# EAGLE design ArduRT-v4 (EAGLE 5.07)
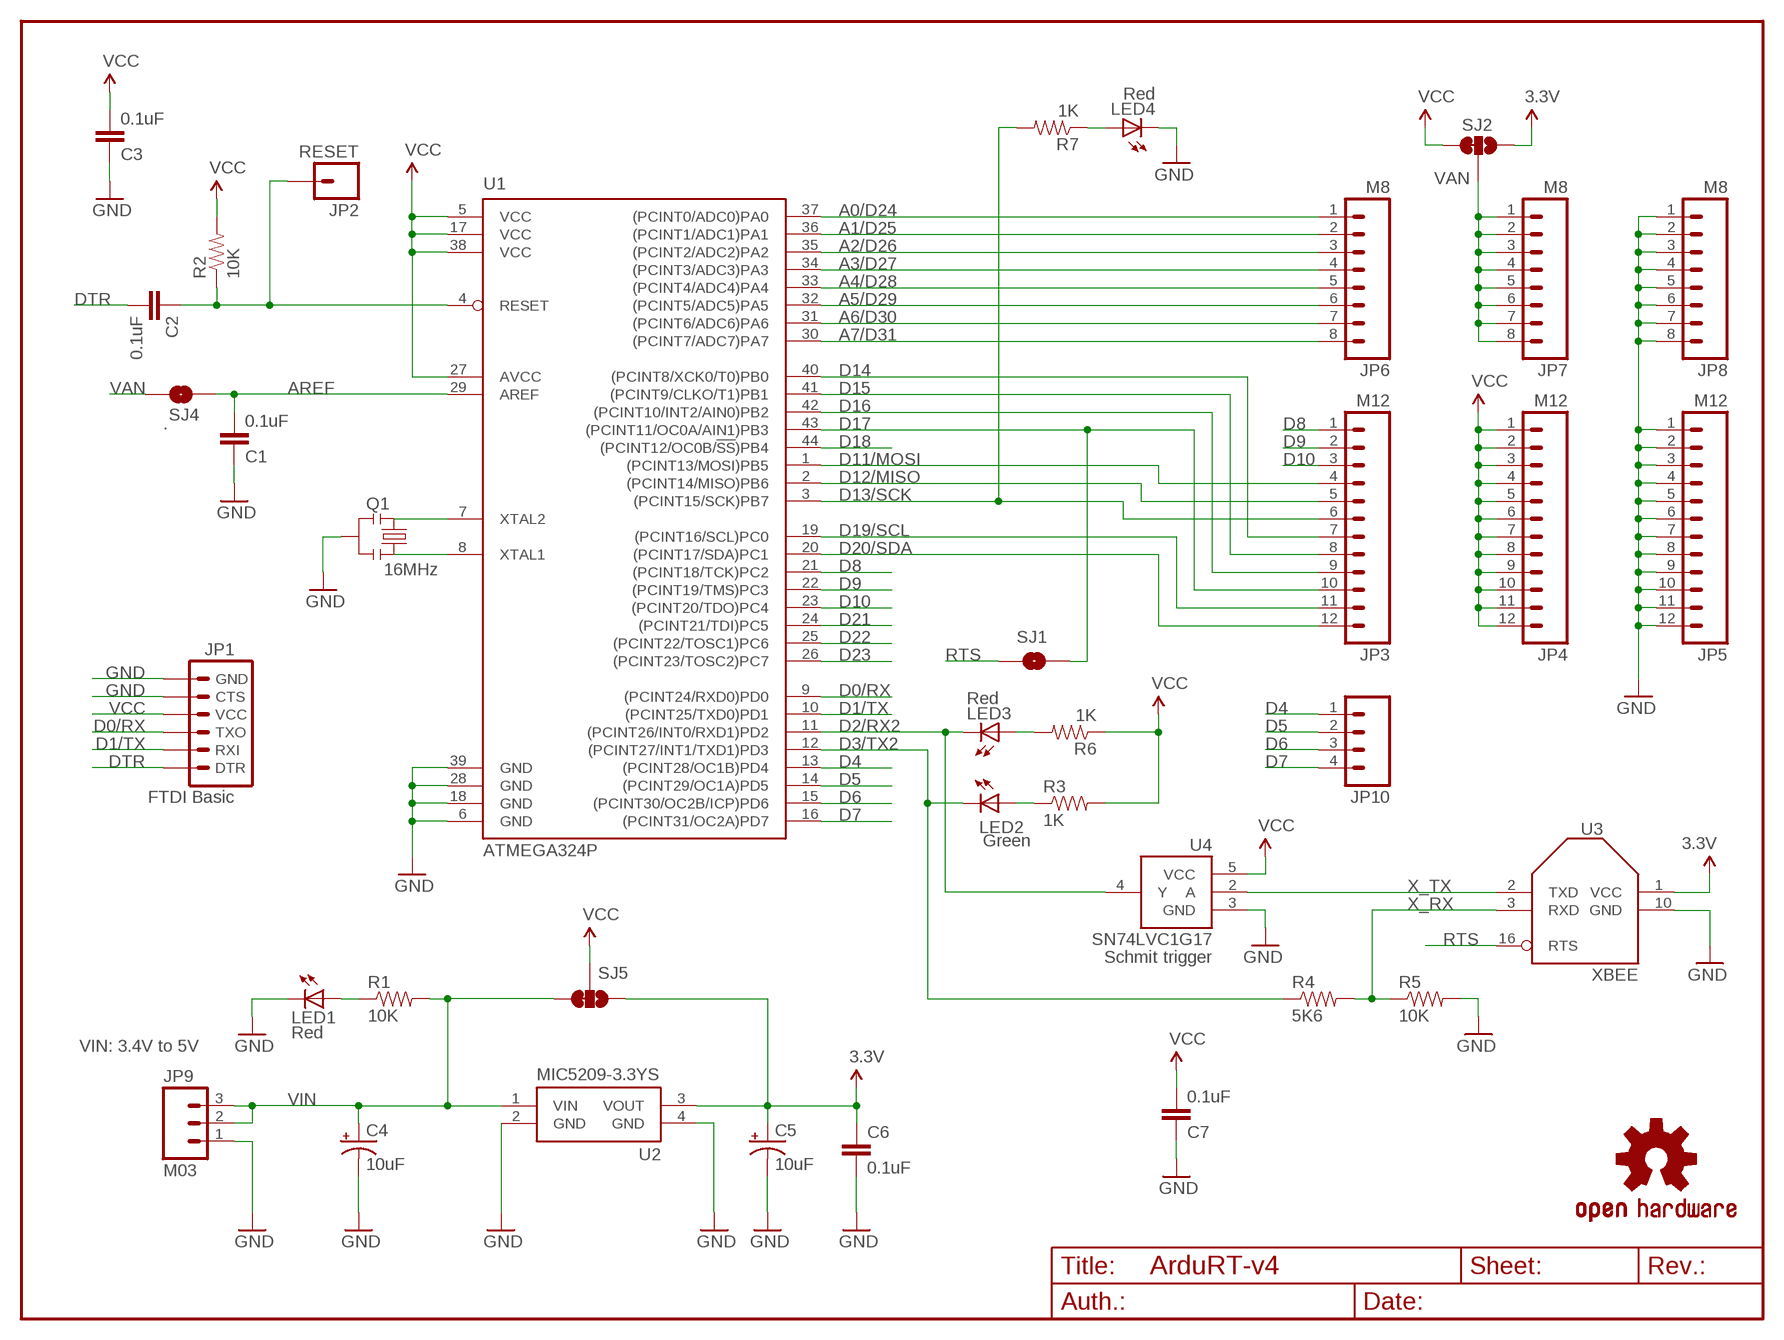
[diagram p0: schematic, sheet 1]

## Parts
C1  0.1uF  CAP0805  [0805]
C2  0.1uF  CAP0805  [0805]
C3  0.1uF  CAP0805  [0805]
C4  10uF  CAP_POL1206  [EIA3216]
C5  10uF  CAP_POL1206  [EIA3216]
C6  0.1uF  CAP0805  [0805]
C7  0.1uF  CAP0805  [0805]
JP1  FTDI Basic  ARDUINO_SERIAL_PROGRAMPTH  [1X06]
JP2  RESET  M01PTH  [1X01]
JP3  M12  M12PTH  [1X12]
JP4  M12  M12PTH  [1X12]
JP5  M12  M12PTH  [1X12]
JP6  M8  M08  [1X08]
JP7  M8  M08  [1X08]
JP8  M8  M08  [1X08]
JP9  M03  [1X3_LONGPAD]
JP10  M04  [1X04]
LED1  Red  LED805  [LED-0805]
LED2  Green  LED805  [LED-0805]
LED3  Red  LED805  [LED-0805]
LED4  Red  LED805  [LED-0805]
Q1  16MHz  RESONATORSMD  [RESONATOR-SMD]
R1  10K  RESISTOR0805-RES  [0805]
R2  10K  RESISTOR0805-RES  [0805]
R3  1K  RESISTOR0805-RES  [0805]
R4  5K6  RESISTOR0805-RES  [0805]
R5  10K  RESISTOR0805-RES  [0805]
R6  1K  RESISTOR0805-RES  [0805]
R7  1K  RESISTOR0805-RES  [0805]
SJ1  SOLDERJUMPERNO  [SJ_2S-NO]
SJ2  SJ_2WAYS_1-2W  [SJ_2WAYS_1-2]
SJ4  .  SOLDERJUMPERTRACE  [SJ_2S-TRACE]
SJ5  SJ_2WAYS_1-2W  [SJ_2WAYS_1-2]
U1  ATMEGA324P  ATMEGA324A  [TQFP44]
U2  MIC5209-3.3YS  MIC5209  [SOT223]
U3  XBEE  XBEE-SIMPLE  [XBEE-MIN]
U4  SN74LVC1G17  [SOT23-5]
U$2  OSHW-LOGOS  [OSHW-LOGO-S]

## Nets
3.3V: C5.A(+) C6.1 SJ2.3 SJ5.3 U2.3(VOUT) U3.1(VCC)
A0/D24: JP6.1 U1.37((PCINT0/ADC0)PA0)
A1/D25: JP6.2 U1.36((PCINT1/ADC1)PA1)
A2/D26: JP6.3 U1.35((PCINT2/ADC2)PA2)
A3/D27: JP6.4 U1.34((PCINT3/ADC3)PA3)
A4/D28: JP6.5 U1.33((PCINT4/ADC4)PA4)
A5/D29: JP6.6 U1.32((PCINT5/ADC5)PA5)
A6/D30: JP6.7 U1.31((PCINT6/ADC6)PA6)
A7/D31: JP6.8 U1.30((PCINT7/ADC7)PA7)
AREF: C1.2 SJ4.2 U1.29(AREF)
D0/RX: JP1.3(TXO) U1.9((PCINT24/RXD0)PD0)
D1/TX: JP1.2(RXI) U1.10((PCINT25/TXD0)PD1)
D2/RX2: LED3.2(C) U1.11((PCINT26/INT0/RXD1)PD2) U4.4(Y)
D3/TX2: LED2.2(C) R4.1 U1.12((PCINT27/INT1/TXD1)PD3)
D4: JP10.1 U1.13((PCINT28/OC1B)PD4)
D5: JP10.2 U1.14((PCINT29/OC1A)PD5)
D6: JP10.3 U1.15((PCINT30/OC2B/ICP)PD6)
D7: JP10.4 U1.16((PCINT31/OC2A)PD7)
D8: JP3.1 U1.21((PCINT18/TCK)PC2)
D9: JP3.2 U1.22((PCINT19/TMS)PC3)
D10: JP3.3 U1.23((PCINT20/TDO)PC4)
D11/MOSI: JP3.4 U1.1((PCINT13/MOSI)PB5)
D12/MISO: JP3.5 U1.2((PCINT14/MISO)PB6)
D13/SCK: JP3.6 R7.2 U1.3((PCINT15/SCK)PB7)
D14: JP3.7 U1.40((PCINT8/XCK0/T0)PB0)
D15: JP3.8 U1.41((PCINT9/CLKO/T1)PB1)
D16: JP3.9 U1.42((PCINT10/INT2/AIN0)PB2)
D17: JP3.10 SJ1.2 U1.43((PCINT11/OC0A/AIN1)PB3)
D18: U1.44((PCINT12/OC0B/!SS!)PB4)
D19/SCL: JP3.11 U1.19((PCINT16/SCL)PC0)
D20/SDA: JP3.12 U1.20((PCINT17/SDA)PC1)
D21: U1.24((PCINT21/TDI)PC5)
D22: U1.25((PCINT22/TOSC1)PC6)
D23: U1.26((PCINT23/TOSC2)PC7)
DTR: C2.2 JP1.1(DTR)
GND [vcc]: C1.1 C3.1 C4.C(-) C5.C(-) C6.2 C7.1 JP1.5(CTS) JP1.6(GND) JP5.1 JP5.2 JP5.3 JP5.4 JP5.5 JP5.6 JP5.7 JP5.8 JP5.9 JP5.10 JP5.11 JP5.12 JP8.1 JP8.2 JP8.3 JP8.4 JP8.5 JP8.6 JP8.7 JP8.8 JP9.1 LED1.2(C) LED4.2(C) Q1.2 R5.2 U1.6(GND) U1.18(GND) U1.28(GND) U1.39(GND) U2.2(GND) U2.4(GND) U3.10(GND) U4.3(GND)
N$1: Q1.1 U1.8(XTAL1)
N$2: Q1.3 U1.7(XTAL2)
N$3: LED2.1(A) R3.1
N$4: LED3.1(A) R6.2
N$5: LED4.1(A) R7.1
N$38: LED1.1(A) R1.1
RESET: C2.1 JP2.1 R2.1 U1.4(RESET)
RTS: SJ1.1 U3.16(RTS)
VAN: JP7.1 JP7.2 JP7.3 JP7.4 JP7.5 JP7.6 JP7.7 JP7.8 SJ2.2 SJ4.1
VCC [vcc]: C3.2 C7.2 JP1.4(VCC) JP4.1 JP4.2 JP4.3 JP4.4 JP4.5 JP4.6 JP4.7 JP4.8 JP4.9 JP4.10 JP4.11 JP4.12 R2.2 R3.2 R6.1 SJ2.1 SJ5.2 U1.5(VCC) U1.17(VCC) U1.27(AVCC) U1.38(VCC) U4.5(VCC)
VIN: C4.A(+) JP9.2 JP9.3 R1.2 SJ5.1 U2.1(VIN)
X_RX: R4.2 R5.1 U3.3(RXD)
X_TX: U3.2(TXD) U4.2(A)

## Notes on the sheet
- Schmit trigger
- VIN: 3.4V to 5V

## Library data of the parts
C1-C3 C6 C7 = SparkFun:CAP: Capacitor Standard 0603 ceramic capacitor, and 0.1" leaded capacitor.
C4 C5 = SparkFun:CAP_POL: Capacitor Polarized These are standard SMD and PTH capacitors. Normally 10uF, 47uF, and 100uF in electrolytic and tantalum varieties. Always verify the external diameter of the through hole cap, it varies with capacity, voltage, and manufacturer. The EIA devices should be standard.
JP1 = SparkFun:ARDUINO_SERIAL_PROGRAM
JP2 = SparkFun:M01: Header 1 Standard 1-pin 0.1" header. Use with straight break away headers (SKU : PRT-00116), right angle break away headers (PRT-00553), swiss pins (PRT-00743), machine pins (PRT-00117), and female headers (PRT-00115).
JP3-JP5 = SparkFun:M12: Header 12 Standard 12-pin 0.1" header. Use with straight break away headers (SKU : PRT-00116), right angle break away headers (PRT-00553), swiss pins (PRT-00743), machine pins (PRT-00117), and female headers (PRT-00115).
JP6-JP8 = wibauxl:M08
JP9 = wibauxl:M03
JP10 = wibauxl:M04
LED1-LED4 = wibauxl:LED
Q1 = SparkFun:RESONATOR: Resonator Small SMD resonator. This is the itty bitty 10/20MHz resonators with built in caps. CSTCE10M0G55 and CSTCE20M0V53. Footprint has been reviewed closely but hasn't been tested yet.
R1-R7 = SparkFun:RESISTOR: Resistor Basic schematic elements and footprints for 0603, 1206, and PTH resistors.
SJ1 SJ4 = SparkFun:SOLDERJUMPER: Solder Jumper Standard SMD solder jumper. Used to automate production. Two varients : Normally Open and Normally Closed are the same, but have different paste layers. NC will have a large amount of paste and should jumper during reflow.
SJ2 SJ5 = wibauxl:SJ_2WAYS_1-2
U1 = wibauxl:ATMEGA324: 8-bit Microcontroller with 64K Bytes In-System Programmable Flash Source: http://www.atmel.com/dyn/resources/prod_documents/doc2593.pdf
U2 = wibauxl:MIC5209
U3 = wibauxl:XBEE-SIMPLE
U4 = wibauxl:SN74LVC1G17
U$2 = SparkFun:OSHW-LOGO: Open Source Hardware Logo This logo indicates the piece of hardware it is found on incorporates a OSHW license and/or adheres to the definition of open source hardware found here: http://freedomdefined.org/OSHW

## Net classes
0 default: width 0.203 mm
1 vcc: width 0.254 mm

## Board
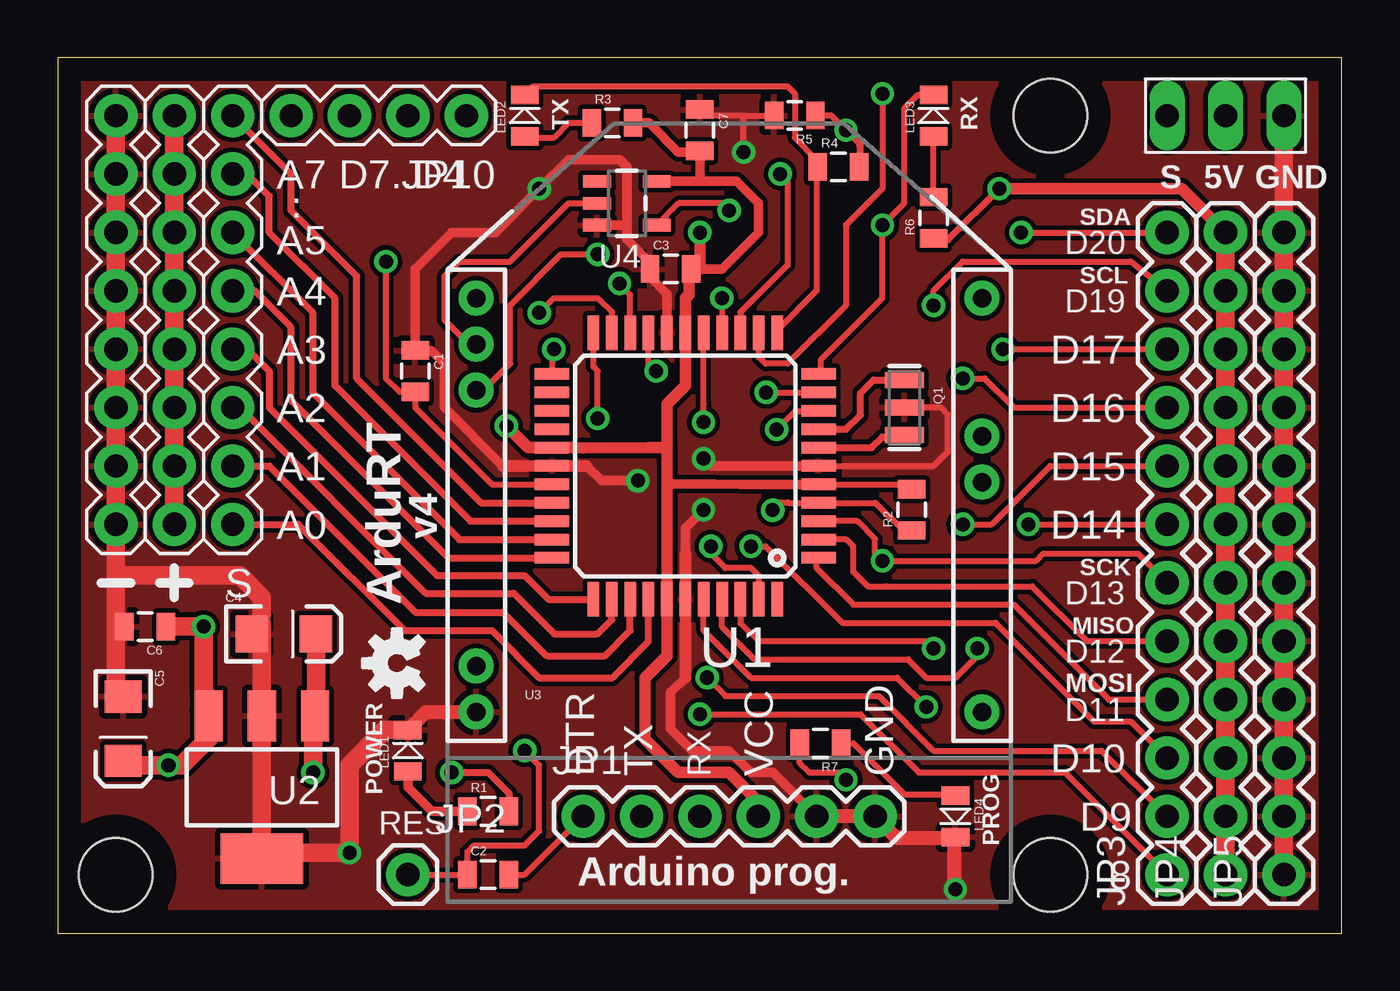
[diagram p1: board, top side]
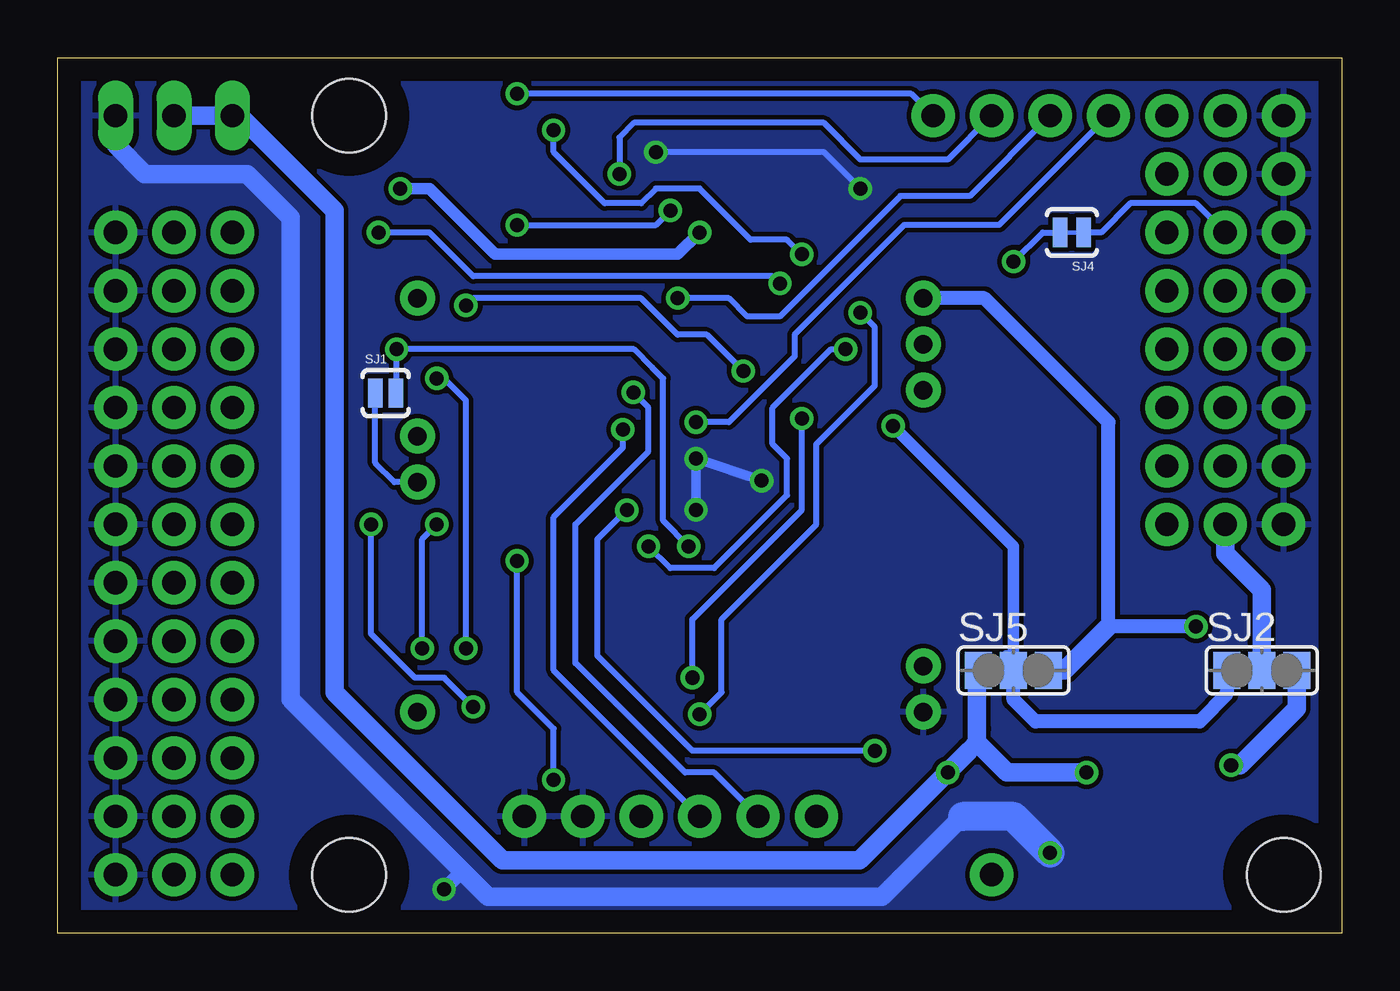
[diagram p2: board, bottom side, seen from below]

Size 55.87 x 38.09 mm. Coordinates in mm from the lower left corner, seen from the top.
Outline: 0,0 55.87,0 55.87,38.09 0,38.09 0,0
Copper layers (1*16): Top 0.035mm / dielectric 1.5mm / Bottom 0.035mm
Design rules "default *": minimum track width 10mil, minimum drill 24mil, track to track 8mil, track to pad 8mil, pad to pad 8mil, via to via 8mil, smd to smd 8mil, copper to edge 40mil, drill to drill 8mil, minimum pad ring 10mil, minimum via ring 8mil, stop-mask expansion 4mil, vias tented up to drill 0mil, thermal gap 10mil
Holes 3.2 mm at 43.18,35.56 2.54,2.54 43.18,2.54

### Footprints (pad centres in the part's own frame; a part is rotated, then mirrored left to right if it is on the bottom)
0805 = smd 0.8 x 1.2: 1 -0.9,0; 2 0.9,0
EIA3216 = smd 1.4 x 1.6: A 1.4,0; C -1.4,0
1X06 = drill 1.016 pad 1.88 round: 1 0,0; 2 2.54,0; 3 5.08,0; 4 7.62,0; 5 10.16,0; 6 12.7,0
1X01 = drill 1.016 pad 1.88 round: 1 0,0
1X12 = drill 1.016 pad 1.88 round: 1 0,0; 2 2.54,0; 3 5.08,0; 4 7.62,0; 5 10.16,0; 6 12.7,0; 7 15.24,0; 8 17.78,0; 9 20.32,0; 10 22.86,0; 11 25.4,0; 12 27.94,0
1X08 = drill 1.016 pad 1.88 round: 1 0,0; 2 2.54,0; 3 5.08,0; 4 7.62,0; 5 10.16,0; 6 12.7,0; 7 15.24,0; 8 17.78,0
1X3_LONGPAD = drill 1.016 pad 1.245 long: 1 0,0; 2 -2.54,0; 3 -5.08,0
1X04 = drill 1.016 pad 1.88 round: 1 0,0; 2 2.54,0; 3 5.08,0; 4 7.62,0
LED-0805 = smd 0.8 x 1.2: 1 -0.9,0; 2 0.9,0
RESONATOR-SMD = smd 0.7 x 1.7: 1 -1.2,0; 2 0,0; 3 1.2,0
SJ_2S-NO = smd 0.635 x 1.27: 1 -0.45,0; 2 0.45,0
SJ_2WAYS_1-2 = smd 1.168 x 1.6: 1 -1.524,0; 2 0,0; 3 1.524,0
SJ_2S-TRACE = smd 0.635 x 1.27: 1 -0.508,0; 2 0.508,0
TQFP44 = smd 1.5 x 0.5: 1 -5.8,4; 2 -5.8,3.2; 3 -5.8,2.4; 4 -5.8,1.6; 5 -5.8,0.8; 6 -5.8,0; 7 -5.8,-0.8; 8 -5.8,-1.6; 9 -5.8,-2.4; 10 -5.8,-3.2; 11 -5.8,-4; 23 5.8,-4; 24 5.8,-3.2; 25 5.8,-2.4; 26 5.8,-1.6; 27 5.8,-0.8; 28 5.8,0; 29 5.8,0.8; 30 5.8,1.6; 31 5.8,2.4; 32 5.8,3.2; 33 5.8,4 | smd 0.5 x 1.5: 12 -4,-5.8; 13 -3.2,-5.8; 14 -2.4,-5.8; 15 -1.6,-5.8; 16 -0.8,-5.8; 17 0,-5.8; 18 0.8,-5.8; 19 1.6,-5.8; 20 2.4,-5.8; 21 3.2,-5.8; 22 4,-5.8; 34 4,5.8; 35 3.2,5.8; 36 2.4,5.8; 37 1.6,5.8; 38 0.8,5.8; 39 0,5.8; 40 -0.8,5.8; 41 -1.6,5.8; 42 -2.4,5.8; 43 -3.2,5.8; 44 -4,5.8
SOT223 = smd 1.219 x 2.235: 1 -2.311,-3.099; 2 0,-3.099; 3 2.311,-3.099 | smd 3.6 x 2.2: 4 0,3.099
XBEE-MIN = drill 0.8 pad 1.524 round: 1 -11,20; 2 -11,18; 3 -11,16; 5 -11,4; 10 -11,2; 11 11,2; 16 11,12; 17 11,14; 20 11,20
SOT23-5 = smd 0.55 x 1.2: 1 -0.95,-1.3; 2 0,-1.3; 3 0.95,-1.3; 4 0.95,1.3; 5 -0.95,1.3

### Placement (x,y rotation side)
C1  15.56,24.45 270 top
C2  18.73,2.54 0 top
C3  26.67,28.89 0 top
C4  9.84,13.02 0 top
C5  2.86,8.89 270 top
C6  3.81,13.34 180 top
C7  27.94,34.92 270 top
JP1  22.86,5.08 0 top
JP2  15.24,2.54 0 top
JP3  48.26,2.54 90 top
JP4  50.8,2.54 90 top
JP5  53.34,2.54 90 top
JP6  7.62,17.78 90 top
JP7  5.08,17.78 90 top
JP8  2.54,17.78 90 top
JP9  53.34,35.56 0 top
JP10  17.78,35.56 180 top
LED1  15.24,7.94 90 top
LED2  20.32,35.56 90 top
LED3  38.1,35.56 90 top
LED4  39.05,5.08 270 top
Q1  36.83,22.86 270 top
R1  18.73,5.3 0 top
R2  37.15,18.41 90 top
R3  24.13,35.24 0 top
R4  33.97,33.34 0 top
R5  32.07,35.56 180 top
R6  38.1,31.11 90 top
R7  33.18,8.26 180 top
SJ1  41.59,23.5 0 bottom
SJ2  3.49,11.43 0 bottom
SJ4  11.75,30.48 180 bottom
SJ5  14.29,11.43 0 bottom
U1  27.3,20.32 180 top
U2  8.89,6.35 180 top
U3  29.21,7.62 0 top
U4  24.77,31.75 270 top
U$2  14.76,11.75 90 top

### Tracks (layer width: path | path; a pad name or v marks a point on that pad's centre or on a via)
3.3V  (via drill 0.61)
  Top 0.61: C5.A 3.04,7.36
  Top 0.813: 3.04,7.36 3.12,7.36 3.17,7.3 v4.83,7.3 5.4,7.3 6.66,8.56 6.66,8.57 U2.3 6.35,9.68 6.67,10.16 6.35,10.48 v6.35,13.34 C6.1
  Bottom 0.254: 18.1,27.62 U3.1
  Bottom 0.61: 18.1,27.62 15.56,27.62 10.16,22.23 10.16,13.34 v6.35,13.34
  Bottom 0.813: SJ2.3 1.97,9.78 4.45,7.3 v4.83,7.3 | SJ5.3 12.06,11.43 10.16,13.34
A0/D24
  Top 0.305: U1.37 25.7,12.69 24.13,11.11 20.95,11.11 18.91,13.16 15.1,13.16 10.48,17.78 JP6.1
A1/D25
  Top 0.305: U1.36 24.91,13.16 23.81,12.06 21.27,12.06 19.38,13.96 15.57,13.96 9.21,20.32 JP6.2
A2/D26
  Top 0.305: U1.35 24.11,13.63 23.5,13.02 21.59,13.02 21.59,13.04 19.85,14.78 16.02,14.78 7.94,22.86 JP6.3
A3/D27
  Top 0.305: U1.34 21.36,14.52 20.32,15.56 16.51,15.56 16.28,15.79 9.21,22.86 9.21,24.45 8.26,25.4 JP6.4
A4/D28
  Top 0.305: U1.33 17.02,16.32 10.16,23.18 10.16,26.35 8.57,27.94 JP6.5
A5/D29
  Top 0.305: U1.32 17.49,17.12 11.11,23.5 11.11,26.99 JP6.6
A6/D30
  Top 0.305: U1.31 17.96,17.92 12.06,23.81 12.06,27.62 9.21,30.48 9.21,32.07 8.26,33.02 JP6.7
A7/D31
  Top 0.305: U1.30 18.43,18.72 13.02,24.13 13.02,28.57 10.16,31.43 10.16,33.02 JP6.8
AREF  (via drill 0.61)
  Top 0.254: U1.29 18.9,19.52 15.56,22.86 C1.2 14.87,23.55 14.29,24.13 v14.29,29.21
  Bottom 0.254: SJ4.2 13.02,30.48 v14.29,29.21
D0/RX  (via drill 0.61)
  Top 0.254: U1.9 32.09,22.72 v31.27,21.91
  Bottom 0.254: v31.27,21.91 31.27,21.11 34.29,18.1 34.29,11.43 JP1.3
D1/TX  (via drill 0.61)
  Top 0.254: v30.82,23.52 U1.10
  Bottom 0.254: JP1.2 27.3,6.99 28.57,6.99 33.34,11.75 33.34,17.78 30.16,20.95 30.16,22.86 v30.82,23.52
D2/RX2  (via drill 0.61)
  Top 0.254: v29.21,31.43 28.89,31.75 27.02,31.75 U4.4 | LED3.2 37.41,36.46 36.83,35.88 36.83,31.75 v35.88,30.8 35.88,27.62 33.21,24.95 33.21,24.32 33.02,24.45 U1.11
  Bottom 0.254: v29.21,31.43 29.84,30.8 v35.88,30.8
D3/TX2
  Top 0.254: U1.12 31.3,26.23 33.02,27.94 33.02,33.02 33.07,33.28 R4.1 33.07,33.39 33.02,33.34 33.02,33.66 32.07,34.61 32.07,36.51 31.75,36.83 20.69,36.83 LED2.2
D4  (via drill 0.61)
  Top 0.254: U1.13 30.5,25.06 30.8,24.77 31.75,24.77 34.29,27.3 34.29,30.8 35.88,32.38 v35.88,36.51
  Bottom 0.254: JP10.1 18.73,36.51 v35.88,36.51
D5  (via drill 0.61)
  Top 0.254: U1.14 29.7,27.01 31.43,28.73 31.75,29.05 31.75,32.7 v31.43,33.02
  Bottom 0.254: v31.43,33.02 31.43,34.61 30.8,35.24 22.54,35.24 20.95,33.66 17.14,33.66 JP10.2
D6  (via drill 0.61)
  Top 0.254: U1.15 28.91,26.05 v28.89,27.62
  Bottom 0.254: v28.89,27.62 26.67,27.62 25.88,26.83 24.92,26.83 24.45,26.83 19.21,32.07 16.19,32.07 JP10.3
D7  (via drill 0.61)
  Top 0.254: v28.1,22.23 28.1,22.54 28.11,23.02 U1.16
  Bottom 0.254: JP10.4 14.92,30.8 19.05,30.8 23.81,26.04 23.81,25.08 26.67,22.23 v28.1,22.23
D8  (via drill 0.61)
  Top 0.254: JP3.1 43.81,6.99 37.47,6.99 34.92,9.53 v27.94,9.53 | U1.21 24.11,26.96 24.13,26.99 23.5,27.62 21.59,27.62 v20.95,26.99
  Bottom 0.254: v20.95,26.99 20.32,26.35 20.32,23.81 22.86,21.27 22.86,17.78 26.99,13.65 26.99,10.48 v27.94,9.53
D9  (via drill 0.61)
  Top 0.254: JP3.2 45.4,7.94 38.1,7.94 35.72,10.32 29.05,10.32 v28.26,11.11 | U1.22 23.3,24.64 23.5,24.45 v23.5,22.38
  Bottom 0.254: v28.26,11.11 28.26,13.65 23.5,18.41 v23.5,22.38
D10  (via drill 0.61)
  Top 0.254: JP3.3 46.67,9.21 45.09,9.21 40.8,13.49 34.13,13.49 30.8,16.83 v30.16,16.83 | U1.23 21.5,25.32 v21.59,25.4
  Bottom 0.254: v30.16,16.83 29.21,15.88 27.3,15.88 24.13,19.05 24.13,20.64 24.77,21.27 24.77,22.86 22.23,25.4 v21.59,25.4
D11/MOSI
  Top 0.254: 33.21,16.32 U1.1 33.02,16.23 33.02,15.88 34.61,14.29 41.59,14.29 45.72,10.16 JP3.4
D12/MISO
  Top 0.254: JP3.5 44.77,12.7 42.39,15.08 36.04,15.08 35.24,15.08 34.61,15.72 34.61,16.83 34.31,17.12 U1.2
D13/SCK  (via drill 0.61)
  Top 0.254: U1.3 34.78,17.92 35.56,17.14 35.56,16.51 v35.88,16.19 42.55,16.19 42.86,16.51 46.99,16.51 JP3.6 | R7.2 32.28,7.41 32.7,6.99 33.97,6.99 v34.29,6.67
  Bottom 0.254: v34.29,6.67 34.29,8.89 35.88,10.48 v35.88,16.19
D14  (via drill 0.61)
  Top 0.254: U1.40 28.11,13.17 30.16,11.11 36.51,11.11 v37.78,9.84 | v42.23,17.78 JP3.7
  Bottom 0.254: v37.78,9.84 39.05,11.11 40.32,11.11 42.23,13.02 v42.23,17.78
D15  (via drill 0.61)
  Top 0.254: U1.41 28.91,13.32 30.32,11.91 36.99,11.91 37.78,11.11 39.05,11.11 40.01,12.06 v40.01,12.38 | v39.37,17.78 40.64,17.78 43.18,20.32 JP3.8
  Bottom 0.254: v40.01,12.38 40.01,17.14 v39.37,17.78
D16  (via drill 0.61)
  Top 0.254: U1.42 29.7,13.47 30.48,12.7 37.78,12.7 v38.1,12.38 | v39.37,24.13 40.32,24.13 41.59,22.86 JP3.9
  Bottom 0.254: v38.1,12.38 38.1,23.18 39.05,24.13 v39.37,24.13
D17  (via drill 0.61)
  Top 0.254: U1.43 30.5,15.53 30.16,15.88 29.05,15.88 28.42,16.51 v28.42,16.83 | v41.12,25.4 JP3.10
  Bottom 0.254: v28.42,16.83 29.53,17.94 29.53,24.13 30,24.61 30.8,25.4 v41.12,25.4 41.27,25.4 41.14,25.27 SJ1.2
D19/SCL  (via drill 0.61)
  Top 0.254: U1.19 25.7,24.75 v26.04,24.45 | v38.1,27.3 38.1,27.94 39.37,29.21 46.67,29.21 JP3.11
  Bottom 0.254: v26.04,24.45 27.62,26.04 28.89,26.04 30.48,27.62 37.78,27.62 v38.1,27.3
D20/SDA  (via drill 0.61)
  Top 0.254: U1.20 24.91,27.76 v24.45,28.26 | v41.91,30.48 JP3.12
  Bottom 0.254: v24.45,28.26 24.77,28.57 37.78,28.57 39.69,30.48 v41.91,30.48
DTR
  Top 0.254: JP1.1 20.32,2.54 C2.2
GND  (via drill 0.61)
  Top 0.254: C3.1 25.87,28.79 | U1.6 38.1,20.32 38.73,20.95 38.73,22.54 38.42,22.86 Q1.2 | 16.25,25.35 16.19,25.4 15.56,25.4 | 29.84,35.56 28.2,35.56 C7.1 | 29.84,35.56 R5.2 | v29.84,33.97 29.84,35.56
  Top 0.305: JP8.1 2.54,15.88 2.86,15.56 2.54,15.56 2.54,13.71 C6.2 | 2.91,10.43 2.91,10.34 C5.C
  Top 0.406: C1.1 16.25,25.35 16.83,24.77 16.83,22.86 19.37,20.32 | 15.56,25.4 15.56,28.89 17.14,30.48 19.05,30.48 v20.95,32.38 22.23,33.66 24.45,33.66 24.77,33.34 24.77,30.8 | v28.1,20.64 28.42,20.32 U1.6 | v25.24,19.68 23.65,19.68 23.02,20.32 | 27.3,11.11 26.67,10.48 26.67,8.89 27.62,7.94 29.21,7.94 30.16,6.99 31.11,6.99 JP1.5 | 27.3,16.51 27.3,17.62 v28.1,18.41 | 24.77,30.8 24.77,30.16 25.72,29.21 C3.1 25.72,29.16 25.72,28.57 26.5,27.79 U1.18 | U4.3 24.76,30.8 24.77,30.8
  Top 0.508: 19.37,20.32 U1.28 23.02,20.32 | 27.3,11.11 U1.39 27.3,16.51
  Top 0.61: JP1.5 JP1.6 36.51,4.13 39,4.13 | LED1.2 16.02,9.62 U3.10 | 39,4.13 LED4.2 | 39,4.13 39,1.96 v39.05,1.91
  Top 0.813: JP5.2 JP5.3 JP5.4 JP5.5 JP5.6 JP5.7 JP5.8 JP5.9 JP5.10 JP5.11 JP5.12 JP9.1 JP5.2 | JP5.2 JP5.1 | JP8.8 JP8.7 JP8.6 JP8.5 JP8.4 JP8.3 JP8.2 JP8.1 2.54,15.56 2.54,10.79 2.91,10.43 | C6.2 2.86,13.28 | 2.65,15.56 2.86,15.56 7.94,15.56 8.89,14.61 8.89,13.84 C4.C 8.89,13.46 U2.2 8.89,3.49 | U2.4 8.89,3.49 | 8.89,3.49 v12.7,3.49 12.7,7.3 14.23,8.84 LED1.2
  Bottom 0.254: v29.84,33.97 22.54,33.97 v20.95,32.38
  Bottom 0.406: 38.42,2.54 38.58,3.02 | v28.1,18.41 v28.1,20.64 v25.24,19.68
  Bottom 0.61: 38.42,2.54 v39.05,1.91
  Bottom 0.813: JP9.1 53.34,34.29 52.07,33.02 47.62,33.02 45.72,31.11 45.72,10.16 38.58,3.02 37.15,1.59 20,1.59 16.51,5.08
  Bottom 1.27: v12.7,3.49 14.29,5.08 16.51,5.08
  pour Bottom: 0,38.1 55.88,38.1 55.88,0 0,0
  pour Top: 0,38.1 55.88,38.1 55.88,0 0,0
N$1
  Top 0.305: Q1.1 35.49,24.06 34.92,23.5 34.92,22.54 34.3,21.92 U1.8
N$2
  Top 0.305: U1.7 35.41,21.12 35.88,21.59 36.76,21.59 Q1.3
N$3
  Top 0.254: LED2.1 20.37,34.61 21.59,34.61 22.23,35.24 R3.1
N$4
  Top 0.254: R6.2 LED3.1
N$5
  Top 0.254: R7.1 34.61,8.26 36.83,6.03 39,6.03 LED4.1
N$38
  Top 0.406: LED1.1 15.24,6.35 16.29,5.3 R1.1
RESET  (via drill 0.61)
  Top 0.254: R2.1 37.09,17.46 36.83,17.46 35.57,18.72 U1.4 31.76,18.72 31.75,18.73 31.43,18.73 v31.1,18.4 | v20.32,7.94 20.95,7.3 20.95,4.45 20.32,3.81 18.1,3.81 17.83,3.54 C2.1 JP2.1
  Bottom 0.254: v20.32,7.94 28.26,7.94 32.38,12.06 32.38,17.14 31.13,18.4 v31.1,18.4
RTS
  Bottom 0.254: SJ1.1 42.04,20.45 41.21,19.62 U3.16
VAN
  Top 0.813: JP7.8 JP7.7 JP7.6 JP7.5 JP7.4 JP7.3 JP7.2 JP7.1
  Bottom 0.254: JP7.6 6.35,31.75 9.21,31.75 10.48,30.48 SJ4.1
  Bottom 0.305: 5.08,16.51 5.21,16.64
  Bottom 0.813: 5.08,16.83 JP7.1 5.08,16.51 3.49,14.92 SJ2.2
VCC  (via drill 0.61)
  Top 0.254: U1.5 36.68,19.52 36.83,19.37 37.15,19.37 | 26.35,21.11 | 26.35,21.11 26.51,21.27
  Top 0.305: 38.1,30.16 38.73,30.16 v40.96,32.38
  Top 0.406: 27.57,34.02 C7.2 27.89,33.97 27.62,33.97 | U1.5 29.68,19.52 28.57,19.53 26.51,19.53 26.51,20.16 | 27.94,32.7 29.53,32.7 30.48,31.75 30.48,30.48 28.89,28.89 27.94,28.89 C3.2 27.46,28.36 | 27.94,32.7 U4.5 | 27.62,33.97 26.99,33.97 25.72,35.24 R3.2 | 27.62,33.97 27.94,33.66 27.94,32.7 | 36.68,19.52 36.68,19.47 R2.2 | 38.1,30.16 R6.1 38.15,30.16
  Top 0.508: 27.94,28.89 v27.94,30.48 | JP4.12 48.9,32.38 v40.96,32.38 | 27.46,28.36 27.46,27.78 27.3,27.62 U1.17 27.3,23.81 26.51,23.02 26.51,21.27 | v19.53,22.07 20.47,21.12 U1.27 22.38,21.12 22.85,21.11 25.72,21.11 26.35,21.11 | JP1.4 30.48,5.71 29.21,6.99 26.99,6.99 25.55,8.42 25.55,11.11 26.51,12.06 U1.38 26.5,15.72 26.51,17.94 26.51,20.16 26.51,21.27 | 26.51,21.27 26.51,20.95
  Top 0.813: JP4.12 JP4.11 JP4.10 JP4.9 JP4.8 JP4.7 JP4.6 JP4.5 JP4.4 JP4.3 JP4.2 JP4.1
  Bottom 0.508: v27.94,30.48 28.89,29.53 36.83,29.53 39.69,32.38 v40.96,32.38 | 14.61,12.06 SJ5.2 14.29,16.83 v19.53,22.07
  Bottom 0.61: SJ5.2 14.29,10.16 13.34,9.21 6.19,9.21 5.02,10.41 SJ2.1
VIN  (via drill 0.61)
  Top 0.305: R1.2 19.63,6.08 18.73,6.99 v17.14,6.99
  Top 0.813: 11.24,10.12 C4.A | 11.24,10.12 U2.1 | 11.24,10.12 11.39,10.12 11.11,9.84 v11.11,6.99
  Bottom 0.305: v17.14,6.99 17.14,7.02 16.21,7.96
  Bottom 0.61: SJ5.1 15.81,11.68 15.88,11.43 15.88,11.75
  Bottom 0.813: JP9.2 JP9.3 47.94,35.56 43.81,31.43 43.81,10.48 36.51,3.17 20.99,3.17 16.21,7.96 15.87,8.29 | 15.87,8.29 15.88,8.89 15.88,11.43 | v11.11,6.99 14.56,6.99 15.87,8.29
X_RX  (via drill 0.61)
  Top 0.254: 34.92,34.29 34.92,33.34 R4.2 34.87,34.24 34.92,34.29 | 34.92,34.29 v34.29,34.92 33.66,35.56 R5.1 | U3.3 18.54,23.62 19.68,24.77 19.68,27.3 21.91,29.53 v23.5,29.53
  Bottom 0.254: v34.29,34.92 34.29,33.97 32.07,31.75 30.48,31.75 29.84,32.38 27.94,32.38 25.72,30.16 24.13,30.16 v23.5,29.53
X_TX
  Top 0.254: U4.2 22.23,31.75 19.68,29.21 17.46,29.21 16.83,28.57 16.83,26.67 17.88,25.62 U3.2

### Text on the board
tPlace: TX | RX | A7 D7..D4 | . | S | 5V | GND | . | SDA | A5 | D20 | SCL | A4 | D19 | A3 | D17 | A2 | D16 | A1 | D15 | A0 | v4 | D14 | SCK | S | ArduRT | D13 | MISO | D12 | MOSI | D11 | DTR | TX | RX | VCC | GND | D10 | POWER | RES | PROG | D9 | Arduino prog. | 8